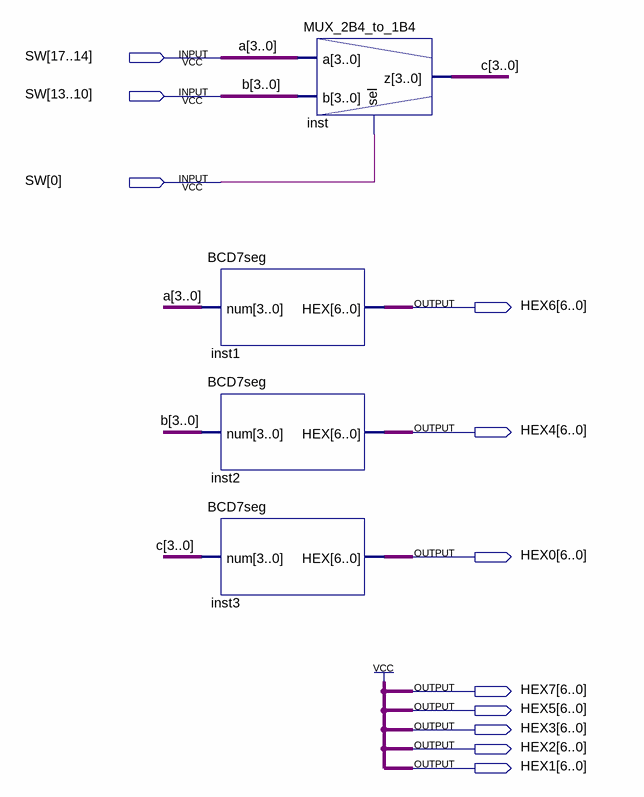
[diagram p0: schematic sheet]
// Quartus schematic P_Mux.bdf as structural Verilog: 4 symbols, 11 pins
module P_Mux (
  input  [17:0] SW,
  output [6:0] HEX6,
  output [6:0] HEX4,
  output [6:0] HEX0,
  output [6:0] HEX7,
  output [6:0] HEX5,
  output [6:0] HEX3,
  output [6:0] HEX2,
  output [6:0] HEX1
);

  wire [3:0] c;

  BCD7seg inst1 (.num(SW[17:14]), .HEX(HEX6));
  BCD7seg inst2 (.num(SW[13:10]), .HEX(HEX4));
  BCD7seg inst3 (.num(c), .HEX(HEX0));
  MUX_2B4_to_1B4 inst (.a(SW[17:14]), .b(SW[13:10]), .sel(SW[0]), .z(c));

  assign HEX1 = {7{1'b1}};
  assign HEX2 = {7{1'b1}};
  assign HEX3 = {7{1'b1}};
  assign HEX5 = {7{1'b1}};
  assign HEX7 = {7{1'b1}};

  // Other names for the same wires on the sheet: a[3:0] = SW[17:14]; b[3:0] = SW[13:10]
endmodule
